# EAGLE schematic EPIP_v173 (EAGLE 9.7.0)
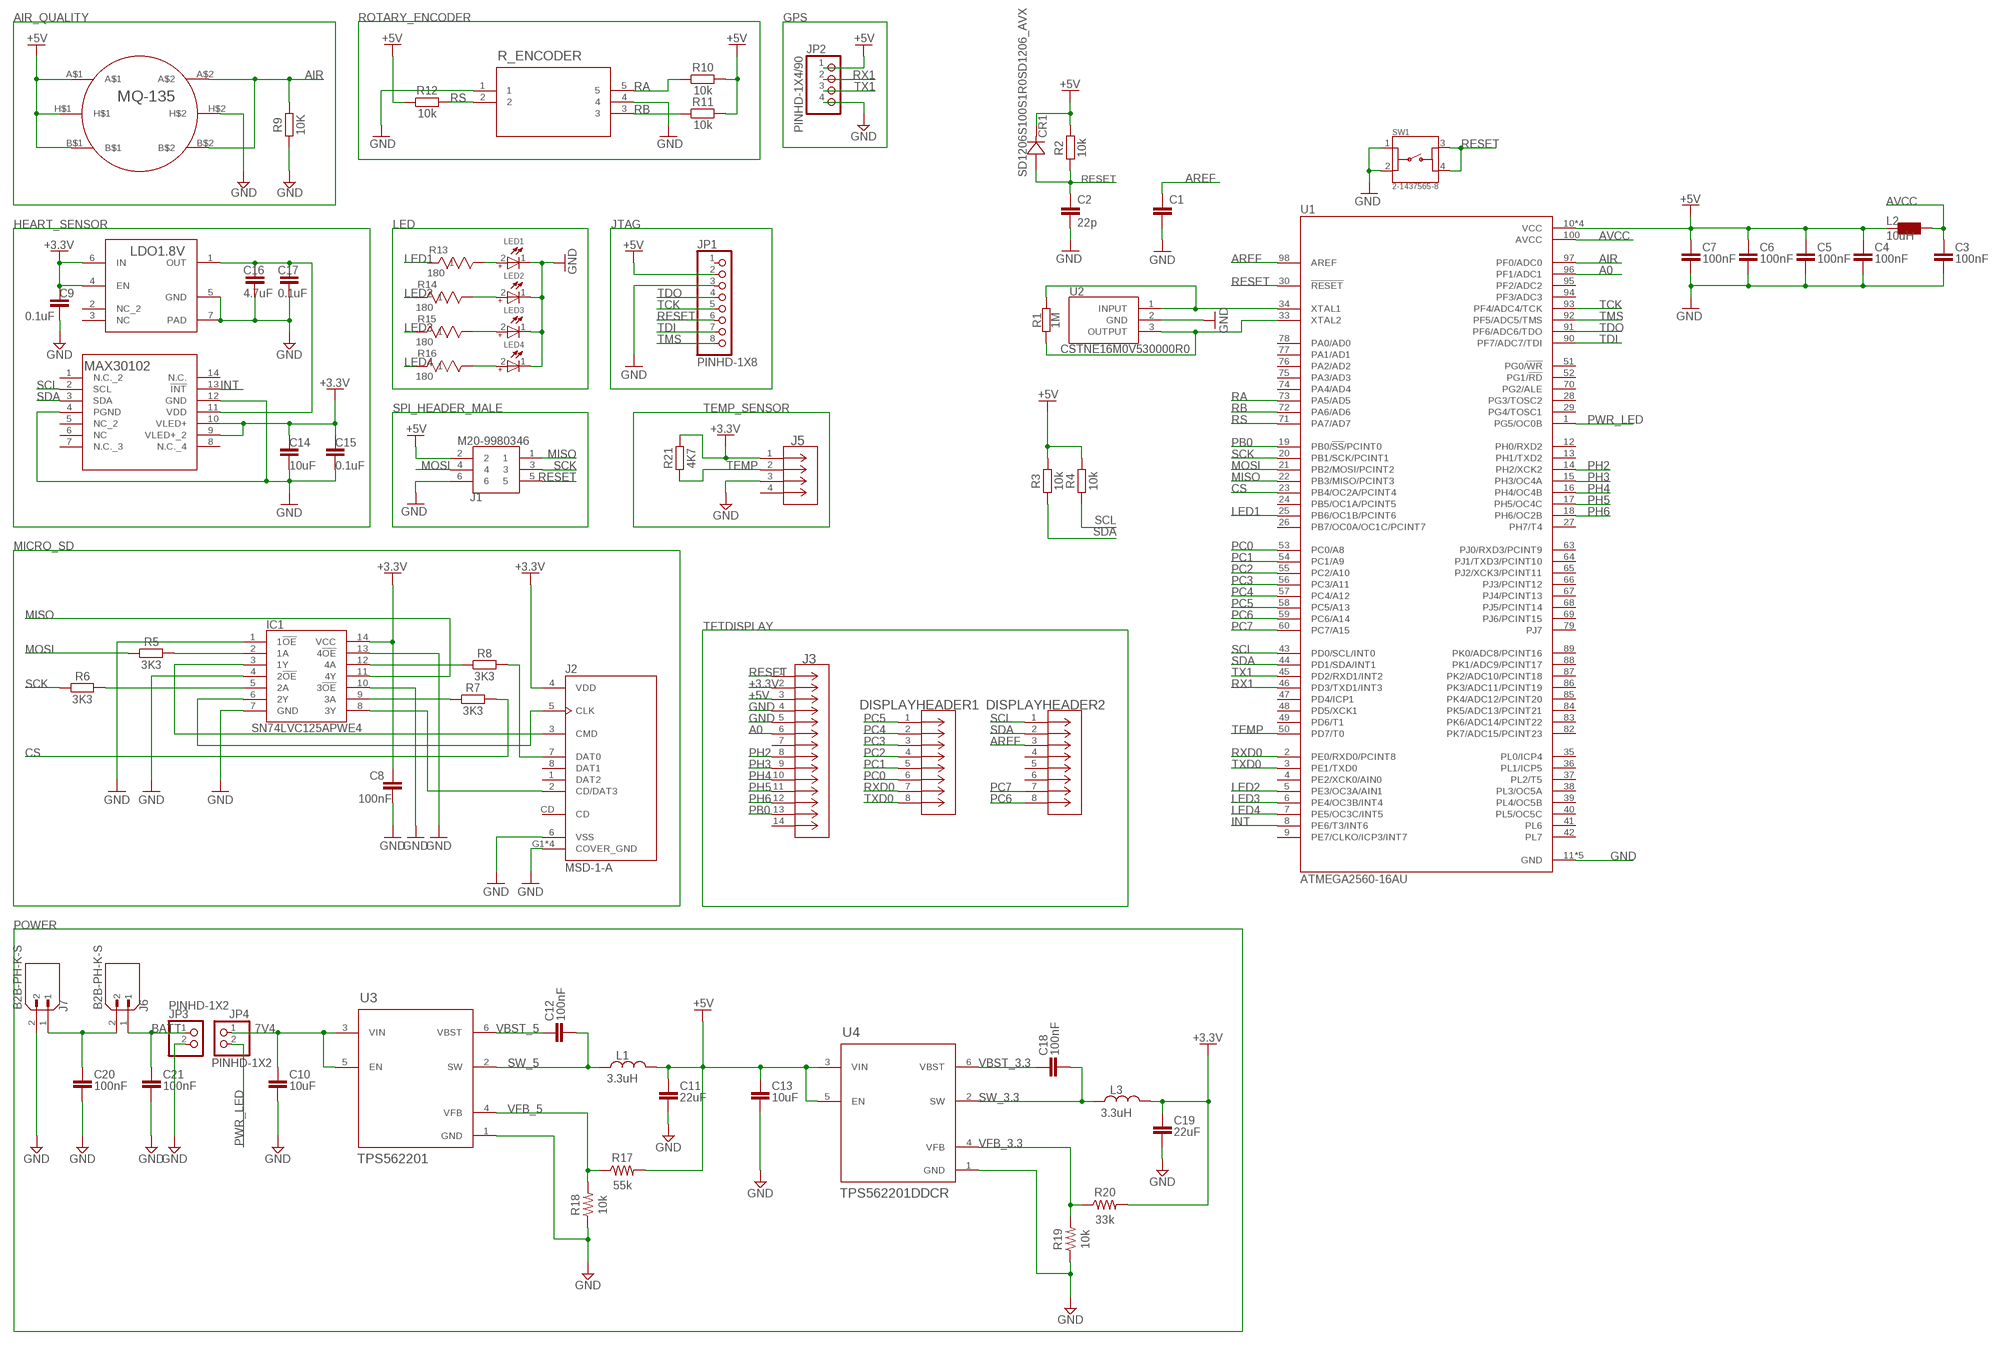
[diagram p0: schematic, sheet 1]

## Parts
C1  100nF  C_CHIP-0603(1608-METRIC)  [CAPC1608X85]
C2  22p  0014_22PF_0603  [C0603-ROUND]
C3  100nF  C_CHIP-0603(1608-METRIC)  [CAPC1608X85]
C4  100nF  C_CHIP-0603(1608-METRIC)  [CAPC1608X85]
C5  100nF  C_CHIP-0603(1608-METRIC)  [CAPC1608X85]
C6  100nF  C_CHIP-0603(1608-METRIC)  [CAPC1608X85]
C7  100nF  C_CHIP-0603(1608-METRIC)  [CAPC1608X85]
C8  100nF  C_CHIP-0603(1608-METRIC)  [CAPC1608X85]
C9  0.1uF  C_CHIP-0805(2012-METRIC)  [CAPC2012X110]
C10  10uF  C_CHIP-0805(2012-METRIC)  [CAPC2012X110]
C11  22uF  C_CHIP-0805(2012-METRIC)  [CAPC2012X110]
C12  100nF  C_CHIP-0603(1608-METRIC)  [CAPC1608X85]
C13  10uF  C_CHIP-0805(2012-METRIC)  [CAPC2012X110]
C14  10uF  C_CHIP-0805(2012-METRIC)  [CAPC2012X110]
C15  0.1uF  C_CHIP-0805(2012-METRIC)  [CAPC2012X110]
C16  4.7uF  C_CHIP-0603(1608-METRIC)  [CAPC1608X85]
C17  0.1uF  C_CHIP-0805(2012-METRIC)  [CAPC2012X110]
C18  100nF  C_CHIP-0603(1608-METRIC)  [CAPC1608X85]
C19  22uF  C_CHIP-0805(2012-METRIC)  [CAPC2012X110]
C20  100nF  C_CHIP-0603(1608-METRIC)  [CAPC1608X85]
C21  100nF  C_CHIP-0603(1608-METRIC)  [CAPC1608X85]
CR1  SD1206S100S1R0SD1206_AVX  [SD1206_AVX]
DISPLAYHEADER1  PPPC081LFBN-RCCONN8_LFBN-RC_SUL  [CONN8_LFBN-RC_SUL]
DISPLAYHEADER2  PPPC081LFBN-RCCONN8_LFBN-RC_SUL  [CONN8_LFBN-RC_SUL]
IC1  SN74LVC125APWE4  [SOP65P640X120-14N]
J1  M20-9980346  [HDRV6W64P254_2X3_762X508X868P]
J2  MSD-1-A  [CUI_MSD-1-A]
J3  PPPC141LFBN-RCCONN14_PPPN141_SUL  [CONN14_PPPN141_SUL]
J5  PPTC041LFBN-RCCONN_PPTC041LFBN-RC_SUL  [CONN_PPTC041LFBN-RC_SUL]
J6  B2B-PH-K-S  [JST_B2B-PH-K-S]
J7  B2B-PH-K-S  [JST_B2B-PH-K-S]
JP1  PINHD-1X8  [1X08]
JP2  PINHD-1X4/90  [1X04/90]
JP3  PINHD-1X2  [1X02]
JP4  PINHD-1X2  [1X02]
L1  3.3uH  L_CHIP-1008(2520-METRIC)  [INDC2520X120N]
L2  10uH  0715_CV201210-100K  [0805]
L3  3.3uH  L_CHIP-1008(2520-METRIC)  [INDC2520X120N]
LDO1.8V  LP5910-1.8DRVRDRV0006A_NV  [DRV0006A_NV]
LED1  WL-TMRW_3MM_WITHOUTSTOPPER  [WL-TMRW_3MM]
LED2  WL-TMRW_3MM_WITHOUTSTOPPER  [WL-TMRW_3MM]
LED3  WL-TMRW_3MM_WITHOUTSTOPPER  [WL-TMRW_3MM]
LED4  WL-TMRW_3MM_WITHOUTSTOPPER  [WL-TMRW_3MM]
MAX30102  MAX30102EFD+T21-1048_F143A5+1_MXM-L  [21-1048_F143A5+1_MXM-L]
R1  1M  R_CHIP-0603(1608-METRIC)  [RESC1608X60]
R2  10k  R_CHIP-0805(2012-METRIC)  [RESC2012X65]
R3  10k  R_CHIP-0805(2012-METRIC)  [RESC2012X65]
R4  10k  R_CHIP-0805(2012-METRIC)  [RESC2012X65]
R5  3K3  R_CHIP-0805(2012-METRIC)  [RESC2012X65]
R6  3K3  R_CHIP-0805(2012-METRIC)  [RESC2012X65]
R7  3K3  R_CHIP-0805(2012-METRIC)  [RESC2012X65]
R8  3K3  R_CHIP-0805(2012-METRIC)  [RESC2012X65]
R9  10K  RESISTOR__CHIP-0805(2012-METRIC)  [RESC2012X65]
R10  10k  R_CHIP-0805(2012-METRIC)  [RESC2012X65]
R11  10k  R_CHIP-0805(2012-METRIC)  [RESC2012X65]
R12  10k  R_CHIP-0805(2012-METRIC)  [RESC2012X65]
R13  180  RMCF0805JT180RSTA_RMCF0805_STP-L  [STA_RMCF0805_STP-L]
R14  180  RMCF0805JT180RSTA_RMCF0805_STP-L  [STA_RMCF0805_STP-L]
R15  180  RMCF0805JT180RSTA_RMCF0805_STP-L  [STA_RMCF0805_STP-L]
R16  180  RMCF0805JT180RSTA_RMCF0805_STP-L  [STA_RMCF0805_STP-L]
R17  55k  R-US_CHIP-0805(2012-METRIC)  [RESC2012X65]
R18  10k  R-US_CHIP-0805(2012-METRIC)  [RESC2012X65]
R19  10k  R-US_CHIP-0805(2012-METRIC)  [RESC2012X65]
R20  33k  R-US_CHIP-0805(2012-METRIC)  [RESC2012X65]
R21  4K7  R_CHIP-0805(2012-METRIC)  [RESC2012X65]
R_ENCODER  EN12-HS22AF30EN12  EN12-HS22AF30EN12-HS_TTE  [EN12-HS_TTE]
SW1  2-1437565-8  [SW_SMD_2-1437565-8_4_4.50_6.00_6.00_5.00]
U1  ATMEGA2560-16AU  [QFP50P1600X1600X120-100N]
U2  CSTNE16M0V530000R0  [CSTNE16M0V530000R0]
U3  TPS562201  TPS562201DDCRDDC0006A_L  [DDC0006A_L]
U4  TPS562201DDCR  TPS562201DDCRDDC0006A_L  [DDC0006A_L]
U$2  MQ_135_A  [MQ-135]

## Nets
7V4: C10.1 JP4.1 U3.3(VIN) U3.5(EN)
+3.3V: C8.1 C9.1 C14.1 C15.1 C19.1 IC1.14(VCC) J2.4(VDD) J3.2 J5.1 L3.2 LDO1.8V.4(EN) LDO1.8V.6(IN) MAX30102.9(VLED+_2) MAX30102.10(VLED+) R20.2 R21.2
+5V: C4.1 C5.1 C6.1 C7.1 C11.1 C13.1 CR1.1 J1.2 J3.3 JP1.2 JP2.1 L1.2 L2.2 R2.2 R3.2 R4.2 R10.2 R11.2 R12.1 R17.2 U1.10(VCC) U1.31(VCC) U1.61(VCC) U1.80(VCC) U4.3(VIN) U4.5(EN) U$2.A$1 U$2.B$1 U$2.H$1
A0: J3.6 U1.96(PF1/ADC1)
AIR: R9.2 U1.97(PF0/ADC0) U$2.A$2 U$2.B$2
AREF: C1.1 DISPLAYHEADER2.3 U1.98(AREF)
AVCC [power usb]: C3.1 L2.1 U1.100(AVCC)
BATT: C21.1 J6.1 JP3.1
CS: R7.2 U1.23(PB4/OC2A/PCINT4)
GND: C1.2 C2.2 C3.2 C4.2 C5.2 C6.2 C7.2 C8.2 C9.2 C10.2 C11.2 C13.2 C14.2 C15.2 C16.2 C17.2 C19.2 C20.2 C21.2 IC1.1(1!OE) IC1.4(2!OE) IC1.7(GND) IC1.10(3!OE) IC1.13(4!OE) J1.6 J2.6(VSS) J2.G1(COVER_GND) J2.G2(COVER_GND) J2.G3(COVER_GND) J2.G4(COVER_GND) J3.4 J3.5 J5.3 J7.2 JP1.3 JP2.4 JP3.2 LDO1.8V.5(GND) LDO1.8V.7(PAD) LED1.1(-) LED2.1(-) LED3.1(-) LED4.1(-) MAX30102.4(PGND) MAX30102.12(GND) R9.1 R18.1 R19.1 R_ENCODER.1 R_ENCODER.4 SW1.1 SW1.2 U1.11(GND) U1.32(GND) U1.62(GND) U1.81(GND) U1.99(GND) U2.2(GND) U3.1(GND) U4.1(GND) U$2.H$2
INT: MAX30102.13(!INT) U1.8(PE6/T3/INT6)
LED1: R13.1 U1.25(PB6/OC1B/PCINT6)
LED2: R14.1 U1.5(PE3/OC3A/AIN1)
LED3: R15.1 U1.6(PE4/OC3B/INT4)
LED4: R16.1 U1.7(PE5/OC3C/INT5)
MISO: IC1.11(4Y) J1.1 U1.22(PB3/MISO/PCINT3)
MOSI: J1.4 R5.1 U1.21(PB2/MOSI/PCINT2)
N$1: R1.2 U1.34(XTAL1) U2.1(INPUT)
N$2: C20.1 J6.2 J7.1
N$4: R1.1 U1.33(XTAL2) U2.3(OUTPUT)
N$6: IC1.2(1A) R5.2
N$7: IC1.3(1Y) J2.3(CMD)
N$8: IC1.9(3A) R7.1
N$9: IC1.5(2A) R6.2
N$10: IC1.6(2Y) J2.5(CLK)
N$11: IC1.8(3Y) J2.2(CD/DAT3)
N$12: IC1.12(4A) R8.1
N$13: J2.7(DAT0) R8.2
N$15: LED1.2(+) R13.2
N$16: LED2.2(+) R14.2
N$18: LED3.2(+) R15.2
N$19: LED4.2(+) R16.2
PB0: J3.13 U1.19(PB0/!SS!/PCINT0)
PC0: DISPLAYHEADER1.6 U1.53(PC0/A8)
PC1: DISPLAYHEADER1.5 U1.54(PC1/A9)
PC2: DISPLAYHEADER1.4 U1.55(PC2/A10)
PC3: DISPLAYHEADER1.3 U1.56(PC3/A11)
PC4: DISPLAYHEADER1.2 U1.57(PC4/A12)
PC5: DISPLAYHEADER1.1 U1.58(PC5/A13)
PC6: DISPLAYHEADER2.8 U1.59(PC6/A14)
PC7: DISPLAYHEADER2.7 U1.60(PC7/A15)
PH2: J3.8 U1.14(PH2/XCK2)
PH3: J3.9 U1.15(PH3/OC4A)
PH4: J3.10 U1.16(PH4/OC4B)
PH5: J3.11 U1.17(PH5/OC4C)
PH6: J3.12 U1.18(PH6/OC2B)
PWR_LED: JP4.2 U1.1(PG5/OC0B)
RA: R10.1 R_ENCODER.5 U1.73(PA5/AD5)
RB: R11.1 R_ENCODER.3 U1.72(PA6/AD6)
RESET: C2.1 CR1.2 J1.5 J3.1 JP1.6 R2.1 SW1.3 SW1.4 U1.30(!RESET)
RS: R12.2 R_ENCODER.2 U1.71(PA7/AD7)
RX1: JP2.2 U1.46(PD3/TXD1/INT3)
RXD0: DISPLAYHEADER1.7 U1.2(PE0/RXD0/PCINT8)
SCK: J1.3 R6.1 U1.20(PB1/SCK/PCINT1)
SCL: DISPLAYHEADER2.1 MAX30102.2(SCL) R4.1 U1.43(PD0/SCL/INT0)
SDA: DISPLAYHEADER2.2 MAX30102.3(SDA) R3.1 U1.44(PD1/SDA/INT1)
SW_3.3 [power usb]: C18.2 L3.1 U4.2(SW)
SW_5: C12.2 L1.1 U3.2(SW)
TCK: JP1.5 U1.93(PF4/ADC4/TCK)
TDI: JP1.7 U1.90(PF7/ADC7/TDI)
TDO: JP1.4 U1.91(PF6/ADC6/TDO)
TEMP: J5.2 R21.1 U1.50(PD7/T0)
TMS: JP1.8 U1.92(PF5/ADC5/TMS)
TX1: JP2.3 U1.45(PD2/RXD1/INT2)
TXD0: DISPLAYHEADER1.8 U1.3(PE1/TXD0)
VBST_3.3 [power usb]: C18.1 U4.6(VBST)
VBST_5 [power usb]: C12.1 U3.6(VBST)
VDD: C16.1 C17.1 LDO1.8V.1(OUT) MAX30102.11(VDD)
VFB_3.3: R19.2 R20.1 U4.4(VFB)
VFB_5: R17.1 R18.2 U3.4(VFB)
Unconnected: DISPLAYHEADER2.4 DISPLAYHEADER2.5 DISPLAYHEADER2.6 J2.1(DAT2) J2.8(DAT1) J2.CD J3.7 J3.14 J5.4 JP1.1 LDO1.8V.2(NC_2) LDO1.8V.3(NC) MAX30102.1(N.C._2) MAX30102.5(NC_2) MAX30102.6(NC) MAX30102.7(N.C._3) MAX30102.8(N.C._4) MAX30102.14(N.C.) U1.4(PE2/XCK0/AIN0) U1.9(PE7/CLKO/ICP3/INT7) U1.12(PH0/RXD2) U1.13(PH1/TXD2) U1.24(PB5/OC1A/PCINT5) U1.26(PB7/OC0A/OC1C/PCINT7) U1.27(PH7/T4) U1.28(PG3/TOSC2) U1.29(PG4/TOSC1) U1.35(PL0/ICP4) U1.36(PL1/ICP5) U1.37(PL2/T5) U1.38(PL3/OC5A) U1.39(PL4/OC5B) U1.40(PL5/OC5C) U1.41(PL6) U1.42(PL7) U1.47(PD4/ICP1) U1.48(PD5/XCK1) U1.49(PD6/T1) U1.51(PG0/!WR) U1.52(PG1/!RD) U1.63(PJ0/RXD3/PCINT9) U1.64(PJ1/TXD3/PCINT10) U1.65(PJ2/XCK3/PCINT11) U1.66(PJ3/PCINT12) U1.67(PJ4/PCINT13) U1.68(PJ5/PCINT14) U1.69(PJ6/PCINT15) U1.70(PG2/ALE) U1.74(PA4/AD4) U1.75(PA3/AD3) U1.76(PA2/AD2) U1.77(PA1/AD1) U1.78(PA0/AD0) U1.79(PJ7) U1.82(PK7/ADC15/PCINT23) U1.83(PK6/ADC14/PCINT22) U1.84(PK5/ADC13/PCINT21) U1.85(PK4/ADC12/PCINT20) U1.86(PK3/ADC11/PCINT19) U1.87(PK2/ADC10/PCINT18) U1.88(PK1/ADC9/PCINT17) U1.89(PK0/ADC8/PCINT16) U1.94(PF3/ADC3) U1.95(PF2/ADC2)

## Library data of the parts
C1 C3-C21 = Capacitor:C: Capacitor - Generic; CATEGORY: Capacitor
C2 = Condensatori:0014_22PF_0603: 22pF 0603; CASE: 0603; MONTHLY_USAGE: _____; PART_NUMBER: 22pF_0603; PRICE: _____; SUPPLIER: _____; TYPE: Condensatori
CR1 = Switching Diode:SD1206S100S1R0; COPYRIGHT: Copyright (C) 2024 Ultra Librarian. All rights reserved.; MANUFACTURER_PART_NUMBER: SD1206S100S1R0; MFR_NAME: KYOCERA AVX
DISPLAYHEADER1 DISPLAYHEADER2 = 2024-12-06_06-21-01_Library:PPPC081LFBN-RC; COPYRIGHT: Copyright (C) 2024 Ultra Librarian. All rights reserved.; MANUFACTURER_PART_NUMBER: PPPC081LFBN-RC; MFR_NAME: Sullins
IC1 = SN74LVC125APWE4:SN74LVC125APWE4: Buffer/Line Driver 4-CH Non-Inverting 3-ST CMOS 14-Pin TSSOP Tube Source: Datasheet <https://www.arrow.com/en/products/sn74lvc125apwe4/texas-instruments>; DESCRIPTION: Buffer/Line Driver 4-CH Non-Inverting 3-ST CMOS 14-Pin TSSOP Tube; HEIGHT: 1.2mm; MANUFACTURER_NAME: Texas Instruments; MANUFACTURER_PART_NUMBER: SN74LVC125APWE4; MOUSER_PART_NUMBER: 595-SN74LVC125APWE4; MOUSER_PRICE-STOCK: https://www.mouser.co.uk/ProductDetail/Texas-Instruments/SN74LVC125APWE4?qs=dT9u2OTAaVUuuUrYuxGzCA%3D%3D
J1 = M20-9980346:M20-9980346: 03+03 DIL Vertical Pin Header HARWIN M20 Series, 2.54mm Pitch 6 Way 2 Row Straight PCB Header, Solder Termination, 3A Source: Datasheet <https://cdn.harwin.com/pdfs/M20-998.pdf>; DESCRIPTION: 03+03 DIL Vertical Pin Header HARWIN M20 Series, 2.54mm Pitch 6 Way 2 Row Straight PCB Header, Solder Termination, 3A; HEIGHT: 8.68mm; MANUFACTURER_NAME: Harwin; MANUFACTURER_PART_NUMBER: M20-9980346; MOUSER_PART_NUMBER: 855-M20-9980346; MOUSER_PRICE-STOCK: https://www.mouser.co.uk/ProductDetail/Harwin/M20-9980346?qs=%252Bk6%2F5FB6qrmHk2P20oz3FA%3D%3D
J2 = MSD-1-A:MSD-1-A; MANUFACTURER: CUI Devices; MAXIMUM_PACKAGE_HEIGHT: 2.00mm; PARTREV: 1.0; STANDARD: Manufacturer Recommendations
J3 = 2024-11-01_20-08-43_Library:PPPC141LFBN-RC; COPYRIGHT: Copyright (C) 2024 Ultra Librarian. All rights reserved.; MANUFACTURER_PART_NUMBER: PPPC141LFBN-RC; MFR_NAME: Sullins; TYPE: Headers, Receptacles, Female Sockets
J5 = 2024-10-25_05-31-16_Library:PPTC041LFBN-RC; COPYRIGHT: Copyright (C) 2024 Ultra Librarian. All rights reserved.; MANUFACTURER_PART_NUMBER: PPTC041LFBN-RC; MFR_NAME: Sullins
J6 J7 = B2B-PH-K-S:B2B-PH-K-S; MANUFACTURER: JST
JP1 = Connector:PINHD-1X8: PIN HEADER; CATEGORY: Headers; DESCRIPTION: Header, Straight, 8 Position; MANUFACTURER: Generic; MPN: Generic; OPERATING_TEMPERATURE: Generic; PART_STATUS: Active; PITCH: 0.100" (2.54mm); ROHS_COMPLIANCE: Generic; SERIES: Generic; SUB-CATEGORY: Headers, Male Pins; TYPE: Board to Board or Cable, Unshrouded, Through Hole, Straight
JP2 = Connector:PINHD-1X4: PIN HEADER; CATEGORY: Headers; DESCRIPTION: Header, Right Angle, 4 Position; MANUFACTURER: Generic; MPN: Generic; OPERATING_TEMPERATURE: Generic; PART_STATUS: Active; PITCH: 0.100" (2.54mm); ROHS_COMPLIANCE: Generic; SERIES: Generic; SUB-CATEGORY: Headers, Male Pins; TYPE: Board to Board or Cable, Unshrouded, Through Hole, Right Angle
JP3 JP4 = Connector:PINHD-1X2: PIN HEADER; CATEGORY: Headers; DESCRIPTION: Header, Straight, 2 Position; MANUFACTURER: Generic; MPN: Generic; OPERATING_TEMPERATURE: Generic; PART_STATUS: Active; PITCH: 0.100" (2.54mm); ROHS_COMPLIANCE: Generic; SERIES: Generic; SUB-CATEGORY: Headers, Male Pins; TYPE: Board to Board or Cable, Unshrouded, Through Hole, Straight
L1 L3 = Inductor:L: Inductor Fixed - Generic; CATEGORY: Inductor; SUB-CATEGORY: Fixed
L2 = Induttanze:0715_CV201210-100K: 10uH 0805; CASE: 0805; MONTHLY_USAGE: _____; PART_NUMBER: CV201210-100K; PRICE: _____; SUPPLIER: _____; TYPE: Induttanze
LDO1.8V = 2024-11-14_00-03-38_Library:LP5910-1.8DRVR; COPYRIGHT: Copyright (C) 2024 Ultra Librarian. All rights reserved.; MANUFACTURER_PART_NUMBER: LP5910-1.8DRVR; MFR_NAME: Texas Instruments; REFDES: RefDes; TYPE: TYPE
LED1-LED4 = WL-TMRW_3MM:WL-TMRW_3MM: WL-TMRW THT Mono-color Round Waterclear Characteristics Low energy consumption High reliability Low current requirement Fast switching No UV/IR radiation Easy installation Ultra high luminous efficacy Versatile mounting on PC boards With and without stopper Applications Indicator light Displays Traffic signal light Marker lights Commercial outdoor advertising Energy saving lamp Backlight LED Displays Electronic and optical indicator PBC mounted panel indicator Variable message sign <https://www.we-online.com/catalog/media/o14911v209%20Family_TMRW_THT.jpg> Details see: www.we-online.com/catalog/en/WL-TMRW <www.we-online.com/catalog/WL-TMRW/?utm_source=eagle_model&utm_medium=description_link&utm_campaign=eisos_eagle> Updated by Ella 2022-06-21 2022(C) Wurth Elektronik
MAX30102 = 2024-09-27_21-19-31_Library:MAX30102EFD+T; COPYRIGHT: Copyright (C) 2024 Ultra Librarian. All rights reserved.; MANUFACTURER_PART_NUMBER: MAX30102EFD+T; MFR_NAME: Analog Devices / Maxim Integrated
R1-R8 R10-R12 R21 = Resistor:R: Resistor Fixed - Generic; CATEGORY: Resistor; SUB-CATEGORY: Fixed
R9 = Tinkercad:RESISTOR: Resistor Fixed - Generic; CATEGORY: Resistor; SUB-CATEGORY: Fixed
R13-R16 = 2024-11-13_23-37-16_Library:RMCF0805JT180R; COPYRIGHT: Copyright (C) 2024 Ultra Librarian. All rights reserved.; MANUFACTURER_PART_NUMBER: RMCF0805JT180R; MFR_NAME: Stackpole International
R17-R20 = Resistor:R-US: Resistor Fixed - ANSI; CATEGORY: Resistor; SUB-CATEGORY: Fixed
R_ENCODER = 2024-10-26_01-15-22_Library:EN12-HS22AF30; COPYRIGHT: Copyright (C) 2024 Ultra Librarian. All rights reserved.; MANUFACTURER_PART_NUMBER: EN12-HS22AF30; MFR_NAME: TT Electronics
SW1 = 2-1437565-8:2-1437565-8: Switch Tactile OFF (ON) SPST Round Button Gull Wing 0.05A 12VDC 2.55N SMD; MANUFACTURER: TE connectivity
U1 = ATmega2560-16AU:ATMEGA2560-16AU; MANUFACTURER: Microchip Technology; MAXIMUM_PACKAGE_HEIGHT: 1.2mm; PARTREV: DS40002211A-05/2020; SNAPEDA_PN: ATMEGA640V-8AUR; STANDARD: IPC-7351B
U2 = CSTNE16M0V530000R0:CSTNE16M0V530000R0: Resonators 16.0000MHz 15pF SMD CHP Resntr Source: Datasheet <https://www.murata.com/products/productdata/8801160822814/SPEC-CSTNE16M0V530000R0.pdf>; DESCRIPTION: Resonators 16.0000MHz 15pF SMD CHP Resntr; HEIGHT: 1mm; MANUFACTURER_NAME: Murata Electronics; MANUFACTURER_PART_NUMBER: CSTNE16M0V530000R0; MOUSER_PART_NUMBER: 81-CSTNE16M0V530000R; MOUSER_PRICE-STOCK: https://www.mouser.co.uk/ProductDetail/Murata-Electronics/CSTNE16M0V530000R0?qs=y6ZabgHbY%252BzQcQICtMt%2F3w%3D%3D
U3 U4 = TPS562201DDCR:TPS562201DDCR; COPYRIGHT: Copyright (C) 2024 Ultra Librarian. All rights reserved.; MANUFACTURER_PART_NUMBER: TPS562201DDCR; MFR_NAME: Texas Instruments; REFDES: RefDes; TYPE: TYPE
U$2 = MQ_135_A:MQ_135_A

## Net classes
1 power: width 0.61 mm, drill 0.406 mm, clearance 0.203 mm
3 power usb: width 0.508 mm, drill 0.406 mm, clearance 0.203 mm